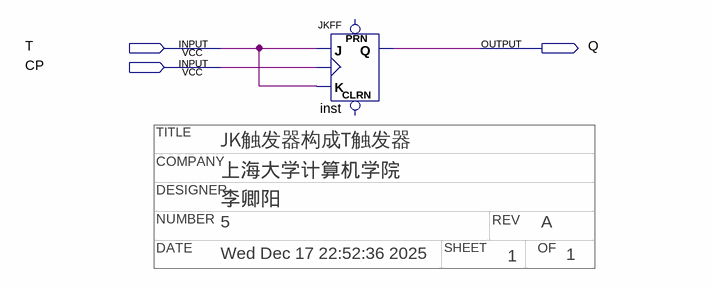
[diagram p0: schematic sheet]
// Quartus schematic sikao5.bdf as structural Verilog: 1 symbols, 3 pins
// Title block: TITLE: JK触发器构成T触发器; COMPANY: 上海大学计算机学院; DESIGNER: 李卿阳; NUMBER: 5; REV: A; DATE: Wed Dec 17 22:52:36 2025; SHEET: 1; OF: 1
module sikao5 (
  input  T,
  input  CP,
  output Q
);

  JKFF inst (.K(T), .J(T), .CLK(CP), .Q(Q));  // open: PRN, CLRN
endmodule
